# Altium schematic sheet Sheet1.SchDoc
size A4
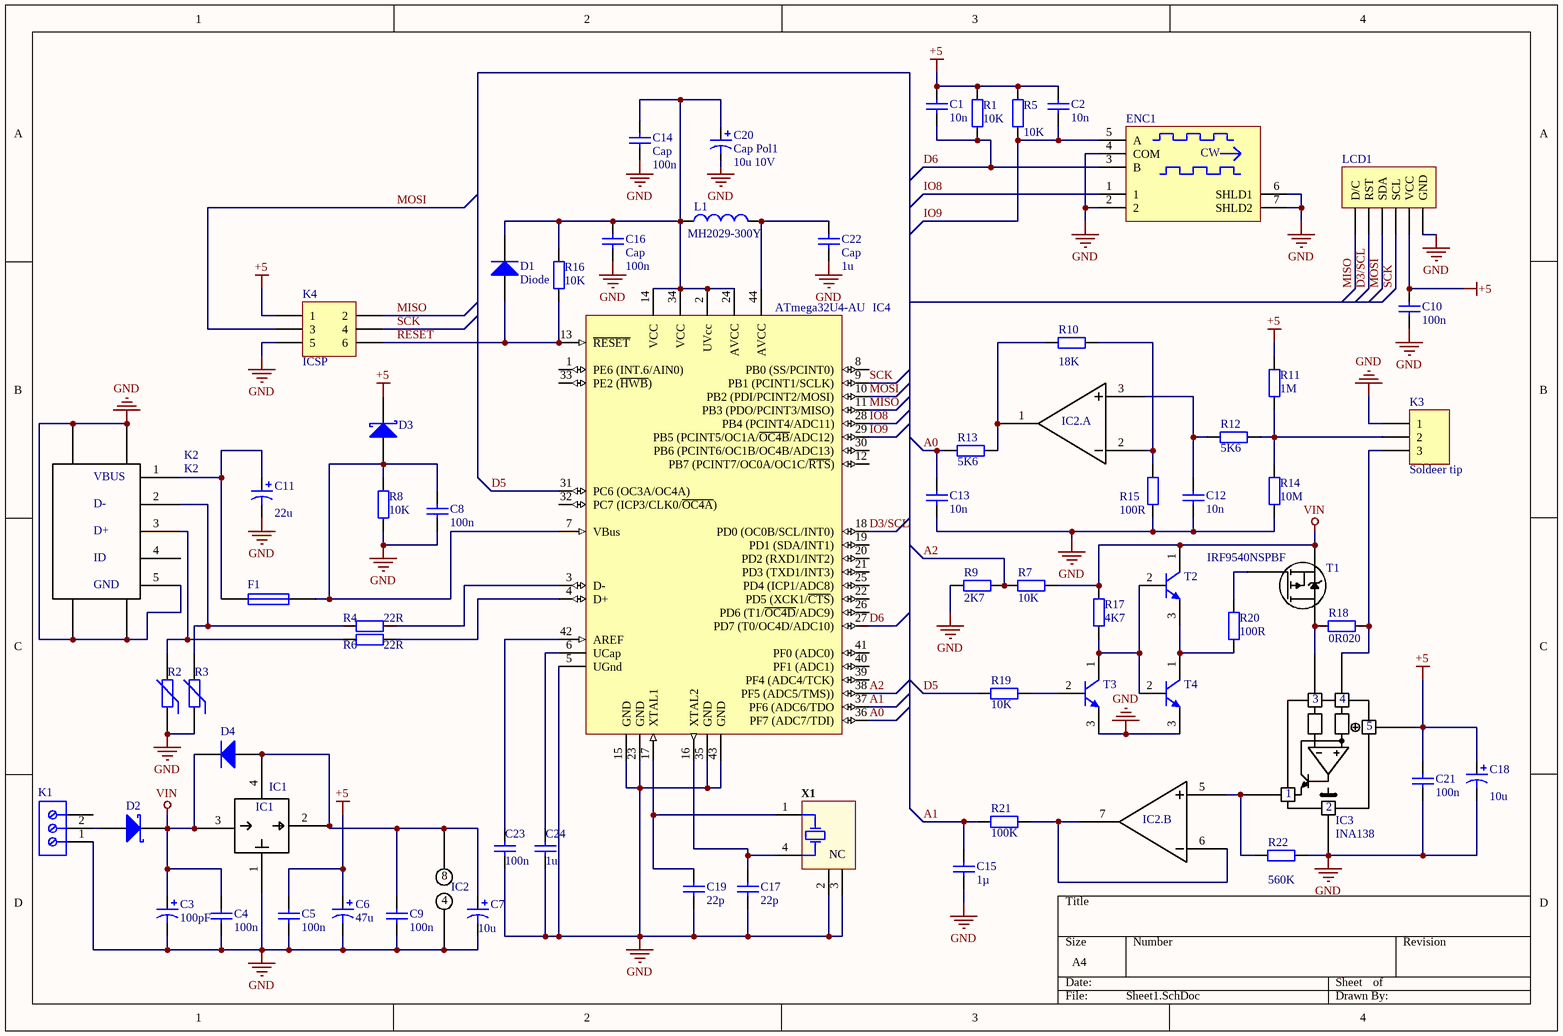
[diagram p0: Sheet1.SchDoc]

## Parts
C1  value 10n  [6-0805_M]  (hidden comment: Cap)
C2  value 10n  [6-0805_M]  (hidden comment: Cap)
C3  value 100pF  [Case C]  (hidden comment: Cap Pol1)
C4  value 100n  [6-0805_M]  (hidden comment: Cap)
C5  value 100n  [6-0805_M]  (hidden comment: Cap)
C6  value 47u  [Case A]  (hidden comment: Cap Pol1)
C7  value 10u  [Case A]  (hidden comment: Cap Pol1)
C8  value 100n  [6-0805_M]  (hidden comment: Cap)
C9  value 100n  [6-0805_M]  (hidden comment: Cap)
C10  value 100n  [6-0805_M]  (hidden comment: Cap)
C11  value 22u  [Case A]  (hidden comment: Cap Pol1)
C12  value 10n  [6-0805_M]  (hidden comment: Cap)
C13  value 10n  [6-0805_M]  (hidden comment: Cap)
C14  Cap  value 100n  [6-0805_M]
C15  value 1µ  [6-0805_M]  (hidden comment: Cap)
C16  Cap  value 100n  [6-0805_M]
C17  value 22p  [6-0805_M]  (hidden comment: Cap)
C18  value 10u  [Case A]  (hidden comment: Cap Pol1)
C19  value 22p  [6-0805_M]  (hidden comment: Cap)
C20  Cap Pol1  value 10u 10V  [Case A]
C21  value 100n  [6-0805_M]  (hidden comment: Cap)
C22  Cap  value 1u  [6-0805_M]
C23  value 100n  [6-0805_M]  (hidden comment: Cap)
C24  value 1u  [6-0805_M]  (hidden comment: Cap)
D1  Diode  [Diode1]
D2  Diode 10TQ035  [DIODE2]  (value not drawn)
D3  Diode 10TQ035  [DIODE3]  (value not drawn)
D4  Diode  [DIODE4]  (value not drawn)
ENC1  PEC11R-4215F-S0024  [ENCODER]  (value not drawn)
F1  Fuse 1  [Fuse]  (value not drawn)
IC1  IC1  [SOT223_M]
IC2  IC2  [IC2]  (value not drawn)  (parts A,B,C of 3)
IC3  INA138  [INA138NA/250G4]
IC4  ATmega32U4-AU  [44ML_M]
K1  691111710003  [K1]  (value not drawn)
K2  K2  [K2]
K3  Soldeer tip  [K3]
K4  ICSP  [K4]
L1  MH2029-300Y  [6-0805_M]
LCD1  Header 6  [HDR1X6]  (value not drawn)
R1  value 10K  [6-0805_M]  (hidden comment: Res2)
R2  Res Varistor  [R2+R3]  (value not drawn)
R3  Res Varistor  [R2+R3]  (value not drawn)
R4  value 22R  [6-0805_M]  (hidden comment: Res2)
R5  value 10K  [6-0805_M]  (hidden comment: Res2)
R6  value 22R  [6-0805_M]  (hidden comment: Res2)
R7  value 10K  [6-0805_M]  (hidden comment: Res2)
R8  value 10K  [6-0805_M]  (hidden comment: Res2)
R9  value 2K7  [6-0805_M]  (hidden comment: Res2)
R10  value 18K  [6-0805_M]  (hidden comment: Res2)
R11  value 1M  [6-0805_M]  (hidden comment: Res2)
R12  value 5K6  [6-0805_M]  (hidden comment: Res2)
R13  value 5K6  [6-0805_M]  (hidden comment: Res2)
R14  value 10M  [6-0805_M]  (hidden comment: Res2)
R15  value 100R  [6-0805_M]  (hidden comment: Res2)
R16  value 10K  [6-0805_M]  (hidden comment: Res2)
R17  value 4K7  [6-0805_M]  (hidden comment: Res2)
R18  value 0R020  [R18]  (hidden comment: Res2)
R19  value 10K  [6-0805_M]  (hidden comment: Res2)
R20  value 100R  [6-0805_M]  (hidden comment: Res2)
R21  value 100K  [6-0805_M]  (hidden comment: Res2)
R22  value 560K  [6-0805_M]  (hidden comment: Res2)
T1  IRF9540NSPBF  [IRF9540NSPBF]
T2  NPN  [BC847]  (value not drawn)
T3  NPN  [BC847]  (value not drawn)
T4  NPN  [BC857]  (value not drawn)
X1  ABS25-32.768KHZ-6-T  [X]  (value not drawn)

## Nets
+5: C1.2 C2.2 C5.2 C6.1 C10.2 C18.1 C21.2 D3.1(K) IC3.5 K4.1 LCD1.5(VCC) R1.2 R5.2 R11.2
GND: C3.2 C4.1 C5.1 C6.2 C7.2 C8.1 C9.1 C10.1 C11.2 C12.1 C13.1 C14.1 C15.1 C16.1 C17.1 C18.2 C19.1 C20.2 C21.1 C22.1 C23.1 C24.1 ENC1.2 ENC1.4(COM) ENC1.6(SHLD1) ENC1.7(SHLD2) IC1.1 IC2.4 IC3.2 IC4.5(UGnd) IC4.15(GND) IC4.23(GND) IC4.35(GND) IC4.43(GND) K1.1 K2.5(GND) K2.SHIELD1 K2.SHIELD2 K2.SHIELD3 K2.SHIELD4 K3.1 K4.5 LCD1.6(GND) R2.1 R3.1 R8.1 R9.1 R14.1 R15.1 R22.2 T3.3(E) T4.3(E) X1.2(NC) X1.3(NC)
VIN: C3.1 C4.2 D2.1(K) D4.2(K) IC1.3 R7.2 R17.2 T1.S T2.1(C)
A0: C13.2 IC4.36(PF7_(ADC7/TDI)) R13.1
A1: C15.2 IC4.37(PF6_(ADC6/TDO) R21.1
A2: IC4.38(PF5_(ADC5/TMS))) R7.1 R9.2
D3/SCL: IC4.18(PD0_(OC0B/SCL/INT0)) LCD1.2(RST)
D5: IC4.31(PC6_(OC3A/OC4A)) R19.1
D6: C1.1 ENC1.3(B) IC4.27(PD7_(T0/OC4D/ADC10)) R1.1
IO8: ENC1.1 IC4.28(PB4_(PCINT4/ADC11))
IO9: C2.1 ENC1.5(A) IC4.29(PB5_(PCINT5/OC1A/~{OC4B}/ADC12)) R5.1
MISO: IC4.11(PB3_(PDO/PCINT3/MISO)) K4.2 LCD1.1(D/C)
MOSI: IC4.10(PB2_(PDI/PCINT2/MOSI)) K4.3 LCD1.3(SDA)
RESET: D1.1(A) IC4.13(~{RESET}) K4.6 R16.1
SCK: IC4.9(PB1_(PCINT1/SCLK)) K4.4 LCD1.4(SCL)
NetC7_1: C7.1 C9.2 D4.1(A) IC1.2 IC1.4 IC2.8
NetC8_2: C8.2 D3.3(A) F1.2 IC4.7(VBus) R8.2
NetC11_1: C11.1 F1.1 K2.1(VBUS)
NetC12_2: C12.2 IC2.3 R12.1
NetC14_2: C14.2 C16.2 C20.1 D1.2(K) IC4.2(UVcc) IC4.14(VCC) IC4.24(AVCC) IC4.34(VCC) L1.1 R16.2
NetC17_2: C17.2 IC4.16(XTAL2) X1.4(X2)
NetC19_2: C19.2 IC4.17(XTAL1) X1.1(X1)
NetC22_2: C22.2 IC4.44(AVCC) L1.2
NetC23_2: C23.2 IC4.42(AREF)
NetC24_2: C24.2 IC4.6(UCap)
NetD2_3: D2.3(A) K1.2
NetIC2_1: IC2.1 R10.1 R13.2
NetIC2_2: IC2.2 R10.2 R15.2
NetIC2_5: IC2.5 IC3.1 R22.1
NetIC2_6: IC2.6 IC2.7 R21.2
NetIC3_3: IC3.3 R18.1 T1.D
NetIC3_4: IC3.4 K3.3 R18.2
NetIC4_3: IC4.3(D-) R4.2
NetIC4_4: IC4.4(D+) R6.2
NetK2_2: K2.2(D-) R3.2 R4.1
NetK2_3: K2.3(D+) R2.2 R6.1
NetK3_2: K3.2 R11.1 R12.2 R14.2
NetR17_1: R17.1 T2.2(B) T3.1(C) T4.2(B)
NetR19_2: R19.2 T3.2(B)
NetR20_1: R20.1 T2.3(E) T4.1(C)
NetR20_2: R20.2 T1.G

Not connected (* = marked no-connect by the designer): IC4 1(PE6_(INT.6/AIN0)) 8(PB0_(SS/PCINT0)) 12(PB7_(PCINT7/OC0A/OC1C/~{RTS})) 19(PD1_(SDA/INT1)) 20(PD2_(RXD1/INT2)) 21(PD3_(TXD1/INT3)) 22(PD5_(XCK1/~{CTS})) 25(PD4_(ICP1/ADC8)) 26(PD6_(T1/~{OC4D}/ADC9)) 30(PB6_(PCINT6/OC1B/OC4B/ADC13)) 32(PC7_(ICP3/CLK0/~{OC4A})) 33(PE2_(~{HWB})) 39(PF4_(ADC4/TCK)) 40(PF1_(ADC1)) 41(PF0_(ADC0)); K1 3; K2 4(ID)

## Notes on the sheet
- (in symbol CMP-1747-00012-1) CW
- (in symbol MCP6002-E/SN, part A) IC2.A
- (in symbol MCP6002-E/SN, part B) IC2.B

## Library data of the parts
C1 C2 C4 C5 C8-C10 C12-C17 C19 C21-C24 = Cap: Capacitor; Published: 8-Jun-2000; LatestRevisionDate: 17-Jul-2002; LatestRevisionNote: Re-released for DXP Platform.; PackageReference: RAD-0.3; Publisher: Altium Limited; PackageDescription: Radial Cap, Thru-Hole; 2 Leads; 0.3 in Pin Spacing
C3 C6 C7 C11 C18 C20 = Cap Pol1: Polarized Capacitor (Radial); Published: 8-Jun-2000; LatestRevisionDate: 17-Jul-2002; LatestRevisionNote: Re-released for DXP Platform.; PackageReference: RB7.6-15; Publisher: Altium Limited; PackageDescription: Polarized Capacitor (Radial); 2 Leads
D1 D4 = Diode: Default Diode; Published: 8-Jun-2000; LatestRevisionDate: 17-Jul-2002; LatestRevisionNote: Re-released for DXP Platform.; PackageVersion: Sep-1996; PackageReference: SMC; Publisher: Altium Limited; PackageDescription: DO-214-AB/SMC; 2 C-Bend Leads; Body 7.9 x 5.9 mm, inc. leads (LxW); Code_JEDEC: DO-214-AB
D2 D3 = Diode 10TQ035: Schottky Rectifier; Note: Terminal 2 is the TAB and is electrically connected to the cathode; Published: 8-Jun-2000; LatestRevisionDate: 17-Jul-2002; LatestRevisionNote: Re-released for DXP Platform.; DatasheetVersion: PD-2.057B; PackageVersion: Feb-1998; PackageReference: TO-220AC; Publisher: Altium Limited; PackageDescription: TO, Thru-Hole, Vertical, Heatsink Mounted; 3 In-Line Leads (1 Absent); Pitch 2.54 mm; ComponentLink1Description: Manufacturer Link; ComponentLink1URL: http://www.irf.com/; ComponentLink2Description: Datasheet; ComponentLink2URL: http://www.irf.com/product-info/datasheets/data/10tq.pdf
ENC1 = CMP-1747-00012-1: 12 mm Incremental Encoder, 24 Detent, -30 to 70 degC, 5-Pin THD, RoHS, Bulk; Case\Package: Axial; Power Rating: 250 mW; Voltage Rating: 250 V; Tolerance: 1%; Resistance: 100 kohm; Mount: Through Hole; Package Quantity: 200; ComponentLink2Description: Datasheet; Max Operating Temperature: 155 degC; Length: 0.248 inch; Packaging: Bulk; ComponentLink2URL: http://www.bourns.com/docs/Product-Datasheets/PEC11R.pdf; Min Operating Temperature: -55 degC; DatasheetVersion: Jul-14; ComponentLink1Description: Manufacturer URL; RoHSCompliant: true; PackageDescription: 5-Pin Through Hole Device, Body 12.5 x 13.4 mm; PackageReference: PEC11R-4XXXF-SXXXX; ComponentLink1URL: http://www.bourns.com/
F1 = Fuse 1: Fuse; Published: 8-Jun-2000; LatestRevisionDate: 17-Jul-2002; LatestRevisionNote: Re-released for DXP Platform.; PackageReference: PIN-W2/E2.8; Publisher: Altium Limited; PackageDescription: Thru-Hole; 2 Leads
IC2 = MCP6002-E/SN: OP Amp Dual GP R-R I/O 6V Automotive 8-Pin SOIC N Tube; Manufacturer: Microchip; Supplier 1: Digi-Key; Manufacturer Part Number: MCP6002-E/SN; RoHS: Yes; Category: Amplifiers - Op Amps, Buffer, Instrumentation; Stock 1: 1931; Pricing 1: 1=0,36000, 25=0,30000, 100=0,27000 (USD); ComponentLink1URL: https://datasheet.ciiva.com/19474/1285896-19474572.pdf?src-supplier=Jameco; ComponentLink1Description: https://datasheet.ciiva.com/19474/1285896-19474572.pdf?src-supplier=Jameco; ComponentLink2URL: https://datasheet.ciiva.com/1793/21733j-1793395.pdf?src-supplier=Digi-Key; ComponentLink2Description: https://datasheet.ciiva.com/1793/21733j-1793395.pdf?src-supplier=Digi-Key; ComponentLink3URL: https://datasheet.ciiva.com/16378/filehandler-aspxddocname-en011705-16378791.pdf?src-supplier=Future+Electronics; ComponentLink3Description: https://datasheet.ciiva.com/16378/filehandler-aspxddocname-en011705-16378791.pdf?src-supplier=Future+Electronics; ComponentLink4URL: https://datasheet.ciiva.com/4756/21733e-41017-4756360.pdf?src-supplier=Mouser; ComponentLink4Description: https://datasheet.ciiva.com/4756/21733e-41017-4756360.pdf?src-supplier=Mouser; ComponentLink5URL: https://datasheet.ciiva.com/7653/524878-7653496.pdf?src-supplier=Element14; ComponentLink5Description: https://datasheet.ciiva.com/7653/524878-7653496.pdf?src-supplier=Element14; ComponentLink6URL: https://datasheet.ciiva.com/11706/jp011705-11706856.pdf?src-supplier=Avnet; ComponentLink6Description: https://datasheet.ciiva.com/11706/jp011705-11706856.pdf?src-supplier=Avnet; ComponentLink7URL: https://datasheet.ciiva.com/14151/bsmicrochip-op-verstaerker-mcp600-en-14151452.pdf?src-supplier=Distrelec; ComponentLink7Description: https://datasheet.ciiva.com/14151/bsmicrochip-op-verstaerker-mcp600-en-14151452.pdf?src-supplier=Distrelec; Supplier Part Number 1: MCP6002-E/SN-ND
IC3 = INA138NA/250G4: SP Amp Current Sense Amp Single 36V 5-Pin SOT-23 T/R; Manufacturer: Texas Instruments; Accuracy: 0.5%; Common Mode Rejection Ratio: 100dB; Number of Channels: 1; Min Supply Voltage: 2.7V; Bandwidth: 800kHz; Operating Supply Voltage: 28V; Nominal Supply Current: 25uA; Operating Supply Current: 45uA; Input Bias Current: 2uA; Input Offset Voltage (Vos): 1mV; Supplier 1: Digi-Key; Manufacturer Part Number: INA138NA/250G4; RoHS: Yes; Category: Amplifiers - Op Amps, Buffer, Instrumentation; Stock 1: 2503; Pricing 1: 1=2,21000, 10=1,98200, 25=1,87000, 100=1,49600 (USD); Mount: Surface Mount; Case/Package: SOT-23; Number of Pins: 5; Weight: 0.000617oz; Contact Plating: Tin,Matte; Min Operating Temperature: -40°C; Max Operating Temperature: 125°C; Packaging: Tape and Reel; Max Supply Voltage: 36V; Number of Elements: 1; Number of Amplifiers: 1; Termination: SMD/SMT; Length: 2.9mm; Height: 1.15mm; Width: 1.6mm; Radiation Hardening: No; Lead Free: Lead Free; REACH SVHC: No SVHC; ComponentLink1URL: https://datasheet.ciiva.com/1940/ina138-1940082.pdf?src-supplier=Digi-Key; ComponentLink1Description: https://datasheet.ciiva.com/1940/ina138-1940082.pdf?src-supplier=Digi-Key; ComponentLink2URL: https://datasheet.ciiva.com/1484/1864388-1484499.pdf?src-supplier=Element14; ComponentLink2Description: https://datasheet.ciiva.com/1484/1864388-1484499.pdf?src-supplier=Element14; ComponentLink3URL: https://datasheet.ciiva.com/2977/ina168-2977829.pdf?src-supplier=Avnet; ComponentLink3Description: https://datasheet.ciiva.com/2977/ina168-2977829.pdf?src-supplier=Avnet; ComponentLink4URL: https://datasheet.ciiva.com/18617/ina138-18617510.pdf?src-supplier=Digi-Key; ComponentLink4Description: https://datasheet.ciiva.com/18617/ina138-18617510.pdf?src-supplier=Digi-Key; ComponentLink5URL: https://datasheet.ciiva.com/18617/ina138-18617511.pdf?src-supplier=Digi-Key; ComponentLink5Description: https://datasheet.ciiva.com/18617/ina138-18617511.pdf?src-supplier=Digi-Key; ComponentLink6URL: https://datasheet.ciiva.com/18617/ina138-18617512.pdf?src-supplier=Digi-Key; ComponentLink6Description: https://datasheet.ciiva.com/18617/ina138-18617512.pdf?src-supplier=Digi-Key; Supplier Part Number 1: 296-35902-1-ND
IC4 = CMP-0095-00285-2: 8-bit AVR Microcontroller, 2.7-5.5V, 16MHz, 32KB Flash, 1KB EEPROM, 2.5KB SRAM, USB Controller, 44-pin TQFP, Industrial Grade (-40°C to 85°C), Ext Osc; RevisionNote: DatasheetVersion updated. URLs added.; ComponentLink1Description: Manufacturer URL; PackageDescription: 44-Pin Plastic Thin Quad Flat Pack, 10 x 10 x 1.0 mm Body, 0.8 mm Pitch (TQFP); DatasheetVersion: revF, Nov-2010; ComponentLink2URL: http://www.atmel.com/dyn/resources/prod_documents/doc7766.pdf; ComponentLink1URL: http://www.atmel.com/; PackageReference: 44ML; ComponentLink2Description: ATmega16U4/32U4 Datasheet; PackageVersion: rev.G, Jul-2007; ComponentLink3URL: http://www.atmel.com/dyn/resources/prod_documents/7766S.pdf; ComponentLink3Description: ATmega16U4 ATmega32U4 Summary
K1 = CMP-1502-03263-1: Series 111 - 5.00 mm Horizontal Entry Modular with Pressure Clamp WR-TBL, 3 pin; Manufacturer: Wurth Elektronik; Pin Number: 3; Pitch: 5.00mm; Packaging: Box; Mounting Technology: THT; Part Number: 691111710003; Manufacturer URL: http://www.we-online.de; Publisher: WurthElektronik; Datasheet URL: http://katalog.we-online.de/em/datasheet/6911117100xx.pdf; Operating Temperature: -40to105degC; Package Reference: 691111710003
K3 = Header 3: Header, 3-Pin; LatestRevisionDate: 17-Jul-2002; LatestRevisionNote: Re-released for DXP Platform.; Publisher: Altium Limited
K4 = Header 3X2: Header, 3-Pin, Dual row; LatestRevisionDate: 17-Jul-2002; LatestRevisionNote: Re-released for DXP Platform.; Publisher: Altium Limited
L1 = Inductor: Code_IEC: 1005; Value: 10mH; Published: 8-Jun-2000; LatestRevisionDate: 29-May-2009; LatestRevisionNote: IPC-7351 Footprint Added.; PackageReference: 0402-A; Publisher: Altium Limited; PackageDescription: Chip Inductor; Code_JEITA: 0402
LCD1 = Header 6: Header, 6-Pin; LatestRevisionDate: 17-Jul-2002; LatestRevisionNote: Re-released for DXP Platform.; Publisher: Altium Limited
R1 R4-R22 = Res2: Resistor; Published: 8-Jun-2000; LatestRevisionDate: 17-Jul-2002; LatestRevisionNote: Re-released for DXP Platform.; PackageReference: AXIAL-0.4; Publisher: Altium Limited; PackageDescription: Axial Device, Thru-Hole; 2 Leads; 0.4 in Pin Spacing
R2 R3 = Res Varistor: Varistor (Voltage-Sensitive Resistor); Published: 24-Mar-1999; LatestRevisionDate: 29-May-2009; LatestRevisionNote: IPC-7351 Footprint Added.; PackageVersion: Mar-2003; PackageReference: 6-0805; Publisher: Altium Limited; PackageDescription: Chip Resistor 0805 Case Size; Code_IPC: RESC2012
T1 = IRF9540NSPBF: International Rectifier IRF9540NSPBF, MOSFET; Continuous Drain Current (ID): 23A; Max Power Dissipation: 3.1W; Drain to Source Voltage (Vdss): 100V; Rise Time: 67ns; Gate to Source Voltage (Vgs): 20V; Turn-Off Delay Time: 51ns; Turn-On Delay Time: 15ns; Input Capacitance: 1.45nF; Number of Elements: 1; Rds On Max: 117mR; Element Configuration: Single; Drain to Source Breakdown Voltage: -100V; Power Dissipation: 3.8W; Nominal Vgs: -4V; Recovery Time: 210ns; Supplier 1: Farnell; Manufacturer: International Rectifier; Manufacturer Part Number: IRF9540NSPBF; RoHS: Yes; Category: MOSFETs; Stock 1: 4486; Pricing 1: 5=1,53000, 10=1,20000, 100=0,87700, 250=0,74400, 500=0,61200, 1000=0,50700, 5000=0,48500 (EUR); Mount: Surface Mount; Case/Package: D2PAK; Number of Pins: 3; Min Operating Temperature: -55°C; Max Operating Temperature: 175°C; Packaging: Rail/Tube; Package Quantity: 50; Fall Time: 51ns; Drain to Source Resistance: 117mR; Dual Supply Voltage: 100V; Length: 10.67mm; Height: 4.83mm; Width: 9.65mm; Radiation Hardening: No; Lead Free: Lead Free; REACH SVHC: No SVHC; ComponentLink1URL: https://datasheet.ciiva.com/19479/1561571-19479846.pdf?src-supplier=Jameco; ComponentLink1Description: https://datasheet.ciiva.com/19479/1561571-19479846.pdf?src-supplier=Jameco; ComponentLink2URL: https://datasheet.ciiva.com/26789/irf9540nspbf-26789462.pdf?src-supplier=IIIC; ComponentLink2Description: https://datasheet.ciiva.com/26789/irf9540nspbf-26789462.pdf?src-supplier=IIIC; ComponentLink3URL: https://datasheet.ciiva.com/7835/irf9540nspbf-7835624.pdf?src-supplier=Element14; ComponentLink3Description: https://datasheet.ciiva.com/7835/irf9540nspbf-7835624.pdf?src-supplier=Element14; ComponentLink4URL: https://datasheet.ciiva.com/948/irf9540nspbf-948490.pdf?src-supplier=Digi-Key; ComponentLink4Description: https://datasheet.ciiva.com/948/irf9540nspbf-948490.pdf?src-supplier=Digi-Key; Supplier Part Number 1: 1298541
T2-T4 = NPN: NPN Bipolar Transistor; Published: 8-Jun-2000; LatestRevisionDate: 17-Jul-2002; LatestRevisionNote: Re-released for DXP Platform.; PackageReference: TO-226-AA; Publisher: Altium Limited; PackageDescription: TO, Flat Index; 3 In-Line, Axial Leads; Body Dia. 4.8mm; Leads 0.55 x 0.51 mm (max); Code_JEDEC: TO-226-AA
X1 = CMP-2000-05036-1: Low Frequency Crystal, 32.768 KHz, 6 pF, +/- 20 ppm, -40 to 85 degC, 4-Pin SMD, RoHS, Tape and Reel; Manufacturer: Abracon; Frequency: 16MHz; Tolerance: 20PPM; ESR: 50kOhms; Case Width: 3.8mm; Case Height: 2.5mm; Case Length: 8mm; Load Capacitance: 6pF; Operating Temperature Range: -40Cto+85C; Package Reference: ABS25; Factory Pack Quantity: 3000; Package Description: 4-Pin Surface Mount Device, Body 8 x 3.8 mm, Pitch 5.5 mm; Termination Style: SMD/SMT; Manufacturer URL: http://www.abracon.com/; Type: LowFrequencyCrystal; Dimensions: 3.8mmWx8mmLx2.5mmH; Product Category: Crystals; Series: ABS25; RoHS: Details; Package / Case: 8mmx3.8mm; Datasheet Version: Jun-17; Brand: ABRACON; Datasheet URL: https://datasheet.ciiva.com/854/abs25-854528.pdf; Packaging: Reel; Mounting Style: SMD/SMT